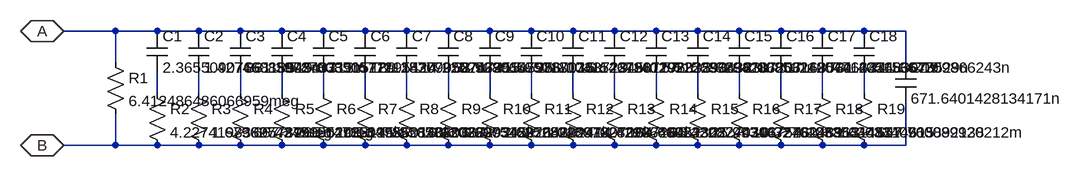
[diagram p0: schematic cpe1.asc]
cpe1.asc, the LTspice schematic file:
Version 4
Sheet 1 1212 680
FLAG 0 0 A
IOPIN 0 0 BiDir
FLAG 0 176 B
IOPIN 0 176 BiDir
WIRE 80 48 80 0
SYMBOL res 64 32 R0
SYMATTR InstName R1
SYMATTR Value 6.412486486066959meg
WIRE 80 128 80 176
SYMBOL cap 128 0 R0
SYMATTR InstName C1
SYMATTR Value 2.3655090766818945m
WIRE 144 96 144 64
SYMBOL res 128 80 R0
SYMATTR InstName R2
SYMATTR Value 4.22741983895789meg
SYMBOL cap 192 0 R0
SYMATTR InstName C2
SYMATTR Value 1.4274608509243711m
WIRE 208 96 208 64
SYMBOL res 192 80 R0
SYMATTR InstName R3
SYMATTR Value 1.67962742799552meg
SYMBOL cap 256 0 R0
SYMATTR InstName C3
SYMATTR Value 861.3978703391572u
WIRE 272 96 272 64
SYMBOL res 256 80 R0
SYMATTR InstName R4
SYMATTR Value 667.3451902923115k
SYMBOL cap 320 0 R0
SYMATTR InstName C4
SYMATTR Value 519.8085051119542u
WIRE 336 96 336 64
SYMBOL res 320 80 R0
SYMATTR InstName R5
SYMATTR Value 265.14785099560146k
SYMBOL cap 384 0 R0
SYMATTR InstName C5
SYMATTR Value 313.67721153099507u
WIRE 400 96 400 64
SYMBOL res 384 80 R0
SYMATTR InstName R6
SYMATTR Value 105.34785282080367k
SYMBOL cap 448 0 R0
SYMATTR InstName C6
SYMATTR Value 189.28777052747355u
WIRE 464 96 464 64
SYMBOL res 448 80 R0
SYMATTR InstName R7
SYMATTR Value 41.856534202639345k
SYMBOL cap 512 0 R0
SYMATTR InstName C7
SYMATTR Value 114.22525690145986u
WIRE 528 96 528 64
SYMBOL res 512 80 R0
SYMATTR InstName R8
SYMATTR Value 16.630329034202642k
SYMBOL cap 576 0 R0
SYMATTR InstName C8
SYMATTR Value 68.92896079787036u
WIRE 592 96 592 64
SYMBOL res 576 80 R0
SYMATTR InstName R9
SYMATTR Value 6.607518970560247k
SYMBOL cap 640 0 R0
SYMATTR InstName C9
SYMATTR Value 41.595018173372345u
WIRE 656 96 656 64
SYMBOL res 640 80 R0
SYMATTR InstName R10
SYMATTR Value 2.625282209180706k
SYMBOL cap 704 0 R0
SYMATTR InstName C10
SYMATTR Value 25.100415221937176u
WIRE 720 96 720 64
SYMBOL res 704 80 R0
SYMATTR InstName R11
SYMATTR Value 1.043070282287264k
SYMBOL cap 768 0 R0
SYMATTR InstName C11
SYMATTR Value 15.146786129233593u
WIRE 784 96 784 64
SYMBOL res 768 80 R0
SYMATTR InstName R12
SYMATTR Value 414.4299648952302
SYMBOL cap 832 0 R0
SYMATTR InstName C12
SYMATTR Value 9.140292222904383u
WIRE 848 96 848 64
SYMBOL res 832 80 R0
SYMATTR InstName R13
SYMATTR Value 164.66023308270306
SYMBOL cap 896 0 R0
SYMATTR InstName C13
SYMATTR Value 5.515687698187207u
WIRE 912 96 912 64
SYMBOL res 896 80 R0
SYMATTR InstName R14
SYMATTR Value 65.42237447937526
SYMBOL cap 960 0 R0
SYMATTR InstName C14
SYMATTR Value 3.328428680616806u
WIRE 976 96 976 64
SYMBOL res 960 80 R0
SYMATTR InstName R15
SYMATTR Value 25.993447248248913
SYMBOL cap 1024 0 R0
SYMATTR InstName C15
SYMATTR Value 2.0085324057766334u
WIRE 1040 96 1040 64
SYMBOL res 1024 80 R0
SYMATTR InstName R16
SYMATTR Value 10.327648686314557
SYMBOL cap 1088 0 R0
SYMATTR InstName C16
SYMATTR Value 1.212044124168307u
WIRE 1104 96 1104 64
SYMBOL res 1088 80 R0
SYMATTR InstName R17
SYMATTR Value 4.103354448114615
SYMBOL cap 1152 0 R0
SYMATTR InstName C17
SYMATTR Value 731.405156673529n
WIRE 1168 96 1168 64
SYMBOL res 1152 80 R0
SYMATTR InstName R18
SYMATTR Value 1.6303340903892138
SYMBOL cap 1216 0 R0
SYMATTR InstName C18
SYMATTR Value 441.364709866243n
WIRE 1232 96 1232 64
SYMBOL res 1216 80 R0
SYMATTR InstName R19
SYMATTR Value 647.760089920212m
WIRE 1296 48 1296 0
SYMBOL cap 1280 48 R0
SYMATTR InstName C19
SYMATTR Value 671.6401428134171n
WIRE 1296 112 1296 176
WIRE 0 0 1296 0
WIRE 0 176 1296 176

The netlist it stands for:
* cpe1.asc
R1 A B 6.412486486066959meg
C1 A N001 2.3655090766818945m
R2 N001 B 4.22741983895789meg
C2 A N002 1.4274608509243711m
R3 N002 B 1.67962742799552meg
C3 A N003 861.3978703391572u
R4 N003 B 667.3451902923115k
C4 A N004 519.8085051119542u
R5 N004 B 265.14785099560146k
C5 A N005 313.67721153099507u
R6 N005 B 105.34785282080367k
C6 A N006 189.28777052747355u
R7 N006 B 41.856534202639345k
C7 A N007 114.22525690145986u
R8 N007 B 16.630329034202642k
C8 A N008 68.92896079787036u
R9 N008 B 6.607518970560247k
C9 A N009 41.595018173372345u
R10 N009 B 2.625282209180706k
C10 A N010 25.100415221937176u
R11 N010 B 1.043070282287264k
C11 A N011 15.146786129233593u
R12 N011 B 414.4299648952302
C12 A N012 9.140292222904383u
R13 N012 B 164.66023308270306
C13 A N013 5.515687698187207u
R14 N013 B 65.42237447937526
C14 A N014 3.328428680616806u
R15 N014 B 25.993447248248913
C15 A N015 2.0085324057766334u
R16 N015 B 10.327648686314557
C16 A N016 1.212044124168307u
R17 N016 B 4.103354448114615
C17 A N017 731.405156673529n
R18 N017 B 1.6303340903892138
C18 A N018 441.364709866243n
R19 N018 B 647.760089920212m
C19 A B 671.6401428134171n
.backanno
.end